# EAGLE design CH376T (EAGLE 7.6.0)
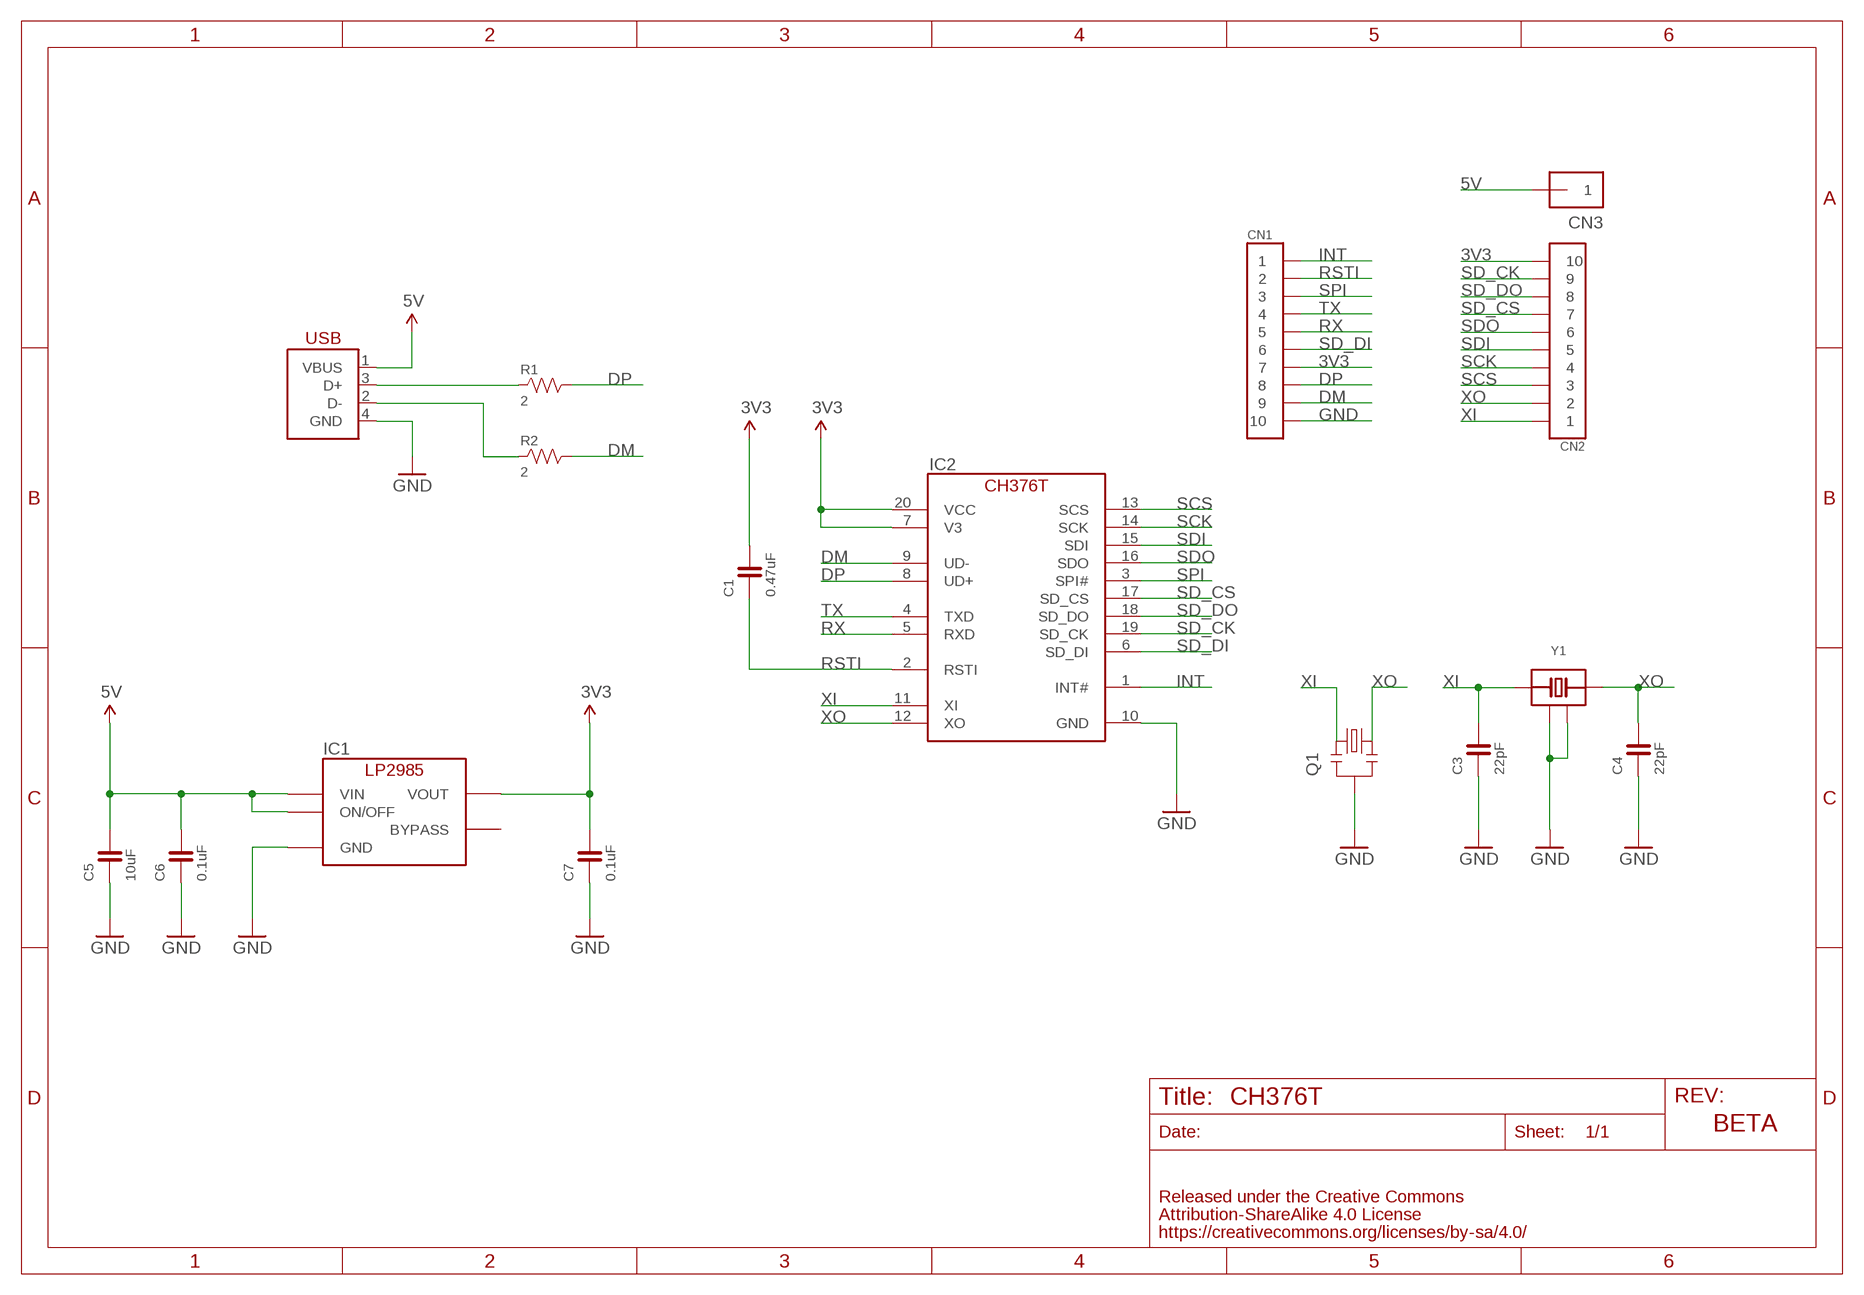
[diagram p0: schematic, sheet 1]

## Parts
C1  0.47uF  CAPACITOR-0603_NARROW  [0603-NARROW]
C3  22pF  CAPACITOR-0603_NARROW  [0603-NARROW]
C4  22pF  CAPACITOR-0603_NARROW  [0603-NARROW]
C5  10uF  CAPACITOR-0603_NARROW  [0603-NARROW]
C6  0.1uF  CAPACITOR-0603_NARROW  [0603-NARROW]
C7  0.1uF  CAPACITOR-0603_NARROW  [0603-NARROW]
CN1  PIN_HEADER_1X10  [PIN_1X10]
CN2  PIN_HEADER_1X10  [PIN_1X10]
CN3  PIN_HEADER_1X1  [PIN_1X1]
IC1  LP2985-33DBV  [SOT-23-5]
IC2  CH376T  [SSOP-20]
Q1  RESONATOR-CSTCE_G  [CSTCE_G]
R1  2  RESISTOR-0603-NARROW  [0603-NARROW]
R2  2  RESISTOR-0603-NARROW  [0603-NARROW]
USB1  USB-B_PTH  [USB-4AF103BS]
Y1  CRYSTAL-ECS-120-12-33Q  [ECS-12MHZ]

## Nets
3V3: C1.2 C7.2 CN1.7 CN2.10 IC1.5(VOUT) IC2.7(V3) IC2.20(VCC)
5V: C5.2 C6.2 CN3.1 IC1.1(VIN) IC1.3(ON/OFF) USB1.1(VBUS)
DM: CN1.9 IC2.9(UD-) R2.2
DP: CN1.8 IC2.8(UD+) R1.2
GND: C3.1 C4.1 C5.1 C6.1 C7.1 CN1.10 IC1.2(GND) IC2.10(GND) Q1.2 USB1.4(GND) Y1.2(GND) Y1.4(GND)
INT: CN1.1 IC2.1(INT#)
N$1: R1.1 USB1.3(D+)
N$2: R2.1 USB1.2(D-)
RSTI: C1.1 CN1.2 IC2.2(RSTI)
RX: CN1.5 IC2.5(RXD)
SCK: CN2.4 IC2.14(SCK)
SCS: CN2.3 IC2.13(SCS)
SD_CK: CN2.9 IC2.19(SD_CK)
SD_CS: CN2.7 IC2.17(SD_CS)
SD_DI: CN1.6 IC2.6(SD_DI)
SD_DO: CN2.8 IC2.18(SD_DO)
SDI: CN2.5 IC2.15(SDI)
SDO: CN2.6 IC2.16(SDO)
SPI: CN1.3 IC2.3(SPI#)
TX: CN1.4 IC2.4(TXD)
XI: C3.2 CN2.1 IC2.11(XI) Q1.1 Y1.1(IO)
XO: C4.2 CN2.2 IC2.12(XO) Q1.3 Y1.3(IO)
Unconnected: IC1.4(BYPASS)

## Notes on the sheet
- BETA

## Library data of the parts
C1 C3-C7 = FaBo-Capacitor:CAPACITOR: CAPACITOR
CN1 CN2 = FaBo-PIN:PIN_HEADER_1X10
CN3 = FaBo-PIN:PIN_HEADER_1X1
IC1 = FaBo-Supply:LP2985: LP2985
IC2 = FaBo-USB:CH376T
Q1 = FaBo-etc:RESONATOR: RESONATOR
R1 R2 = FaBo-Resistors:RESISTOR: RESISTOR
USB1 = FaBo-USB:USB
Y1 = FaBo-Crystal:CRYSTAL-ECS

## Board
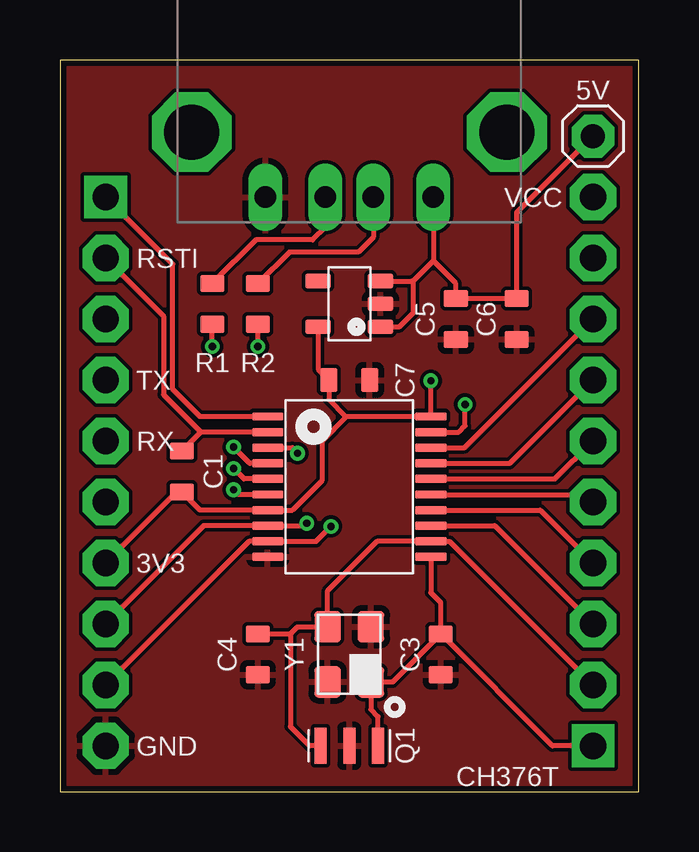
[diagram p1: board, top side]
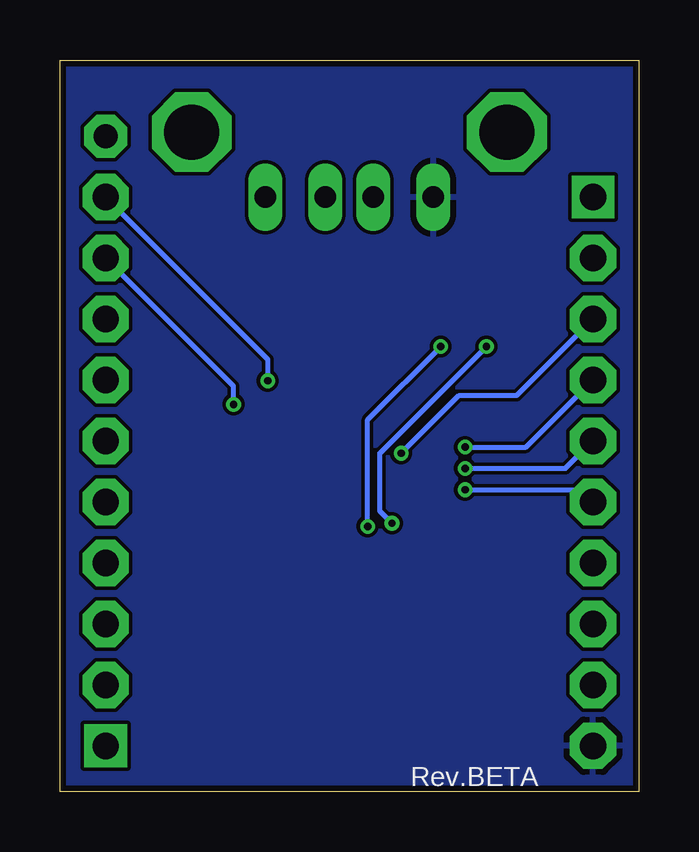
[diagram p2: board, bottom side, seen from below]

Size 24.13 x 30.48 mm. Coordinates in mm from the lower left corner, seen from the top.
Outline: 0,0 24.13,0 24.13,30.48 0,30.48 0,0
Copper layers (1*16): Top 0.035mm / dielectric 1.5mm / Bottom 0.035mm
Design rules "Elecrow_angle": minimum track width 6mil, minimum drill 12mil, track to track 6mil, track to pad 6mil, pad to pad 6mil, via to via 6mil, smd to smd 0mil, copper to edge 10mil, drill to drill 10mil, minimum pad ring 10mil, minimum via ring 6mil, stop-mask expansion 2mil, vias tented up to drill 100mil, thermal gap 10mil

### Footprints (pad centres in the part's own frame; a part is rotated, then mirrored left to right if it is on the bottom)
0603-NARROW = smd 0.71 x 1: 1 -0.85,0; 2 0.85,0
PIN_1X10 = drill 1.1 pad 1.778 square: 1 -11.43,0 | drill 1.1 pad 1.93 octagon: 2 -8.89,0; 3 -6.35,0; 4 -3.81,0; 5 -1.27,0; 6 1.27,0; 7 3.81,0; 8 6.35,0; 9 8.89,0; 10 11.43,0
PIN_1X1 = drill 1 pad 1.778 octagon: 1 0,0
SOT-23-5 = smd 0.6 x 1.05: 1 -0.95,-1.3; 2 0,-1.3; 3 0.95,-1.3; 4 0.95,1.3; 5 -0.95,1.3
SSOP-20 = smd 0.35 x 1.3: 1 -2.925,-3.4; 2 -2.275,-3.4; 3 -1.625,-3.4; 4 -0.975,-3.4; 5 -0.325,-3.4; 6 0.325,-3.4; 7 0.975,-3.4; 8 1.625,-3.4; 9 2.275,-3.4; 10 2.925,-3.4; 11 2.925,3.4; 12 2.275,3.4; 13 1.625,3.4; 14 0.975,3.4; 15 0.325,3.4; 16 -0.325,3.4; 17 -0.975,3.4; 18 -1.625,3.4; 19 -2.275,3.4; 20 -2.925,3.4
CSTCE_G = smd 0.5 x 1.5: 1 -1.2,0; 2 0,0; 3 1.2,0
USB-4AF103BS = drill 0.9 long: 1 3.5,0; 2 1,0; 3 -1,0; 4 -3.5,0 | drill 2.3 octagon: P$1 -6.57,2.71; P$2 6.57,2.71
ECS-12MHZ = smd 1.3 x 1.1: 1 -1.15,-0.9; 2 1.15,-0.9; 3 1.15,0.9; 4 -1.15,0.9

### Placement (x,y rotation side)
C1  5.08,13.34 270 top
C3  15.88,5.71 90 top
C4  8.26,5.71 90 top
C5  16.51,19.68 90 top
C6  19.05,19.68 90 top
C7  12.06,17.14 180 top
CN1  1.91,13.34 270 top
CN2  22.23,13.34 90 top
CN3  22.23,27.3 0 top
IC1  12.06,20.32 90 top
IC2  12.06,12.7 270 top
Q1  12.06,1.91 180 top
R1  6.35,20.32 270 top
R2  8.26,20.32 270 top
USB1  12.06,24.77 0 top
Y1  12.06,5.71 90 top

### Tracks (layer width: path | path; a pad name or v marks a point on that pad's centre or on a via)
3V3  (via drill 0.3)
  Top 0.203: IC1.5 10.77,17.59 C7.2 11.21,16.34 11.93,15.62 | 11.93,15.62 IC2.20 v15.46,17.12 | 11.93,15.62 10.92,14.61 10.92,12.95 9.69,11.72 IC2.7 5.84,11.72 C1.2 4.87,12.48 CN1.7
  Bottom 0.203: CN2.10 15.46,18 v15.46,17.12
5V
  Top 0.203: IC1.1 14.16,19.37 14.73,19.94 14.73,21.21 | 14.73,21.21 14.73,21.28 15.56,22.11 | CN3.1 19.05,24.13 C6.2 C5.2 16.51,21.17 15.56,22.11 | USB1.1 15.56,22.11 | IC1.3 14.67,21.27 14.73,21.21
DM  (via drill 0.3)
  Top 0.203: CN1.9 7.88,10.43 IC2.9 10.68,10.43 v11.3,11.05 | v8.26,18.54 R2.2
  Bottom 0.203: v8.26,18.54 11.3,15.49 v11.3,11.05
DP  (via drill 0.3)
  Top 0.203: CN1.8 6,11.07 IC2.8 10.19,11.07 v10.29,11.18 | v6.35,18.54 R1.2
  Bottom 0.203: v10.29,11.18 10.79,11.68 10.79,14.1 v6.35,18.54
GND
  pour Bottom: 0,30.48 24.13,30.48 24.13,0 0,0
  pour Top: 0,30.48 24.13,30.48 24.13,0 0,0
INT
  Top 0.203: IC2.1 5.84,15.62 4.7,16.76 4.7,21.97 CN1.1
N$1
  Top 0.203: USB1.3 11.06,23.51 10.54,22.99 8.17,22.99 R1.1
N$2
  Top 0.203: USB1.2 13.06,23.1 12.45,22.48 9.56,22.48 R2.1
RSTI
  Top 0.203: IC2.2 5.87,14.97 | 5.87,14.97 C1.1 | 5.87,14.97 5.87,14.99 4.32,16.54 4.32,19.81 CN1.2
RX  (via drill 0.3)
  Top 0.203: IC2.5 7.68,13.03 v7.24,13.46
  Bottom 0.203: v7.24,13.46 3.05,13.46 CN1.5
SCK
  Top 0.203: IC2.14 20.02,11.72 CN2.4
SCS
  Top 0.203: IC2.13 18.14,11.07 CN2.3
SD_CK  (via drill 0.3)
  Top 0.203: IC2.19 16.63,14.97 16.89,15.24 v16.89,16.13
  Bottom 0.203: v16.89,16.13 16.89,16.89 CN2.9
SD_CS
  Top 0.203: IC2.17 18.75,13.68 CN2.7
SD_DI  (via drill 0.3)
  Top 0.203: IC2.6 7.44,12.38 v7.24,12.57
  Bottom 0.203: v7.24,12.57 2.41,12.57 CN1.6
SD_DO
  Top 0.203: IC2.18 16.86,14.32 CN2.8
SDI
  Top 0.203: IC2.15 21.91,12.38 CN2.5
SDO
  Top 0.203: IC2.16 20.64,13.03 CN2.6
SPI  (via drill 0.3)
  Top 0.203: IC2.3 9.68,14.32 v9.91,14.1
  Bottom 0.203: v9.91,14.1 7.49,16.51 5.08,16.51 CN1.3
TX  (via drill 0.3)
  Top 0.203: IC2.4 7.92,13.68 v7.24,14.35
  Bottom 0.203: v7.24,14.35 4.7,14.35 CN1.4
XI
  Top 0.203: C3.2 15.88,7.87 15.46,8.28 IC2.11 | C3.2 13.88,4.57 Y1.1 12.96,3.42 13.27,3.12 Q1.1 | CN2.1 20.54,1.91 C3.2
XO
  Top 0.203: C4.2 9.61,6.57 | 9.61,6.57 9.91,6.86 11.16,6.86 Y1.3 11.16,8.37 13.22,10.43 IC2.12 16.25,10.43 CN2.2 | Q1.3 10.41,1.91 9.61,2.71 9.61,6.57

### Text on the board
tPlace: 5V | VCC | RSTI | TX | RX | 3V3 | GND | CH376T
bPlace: Rev.BETA